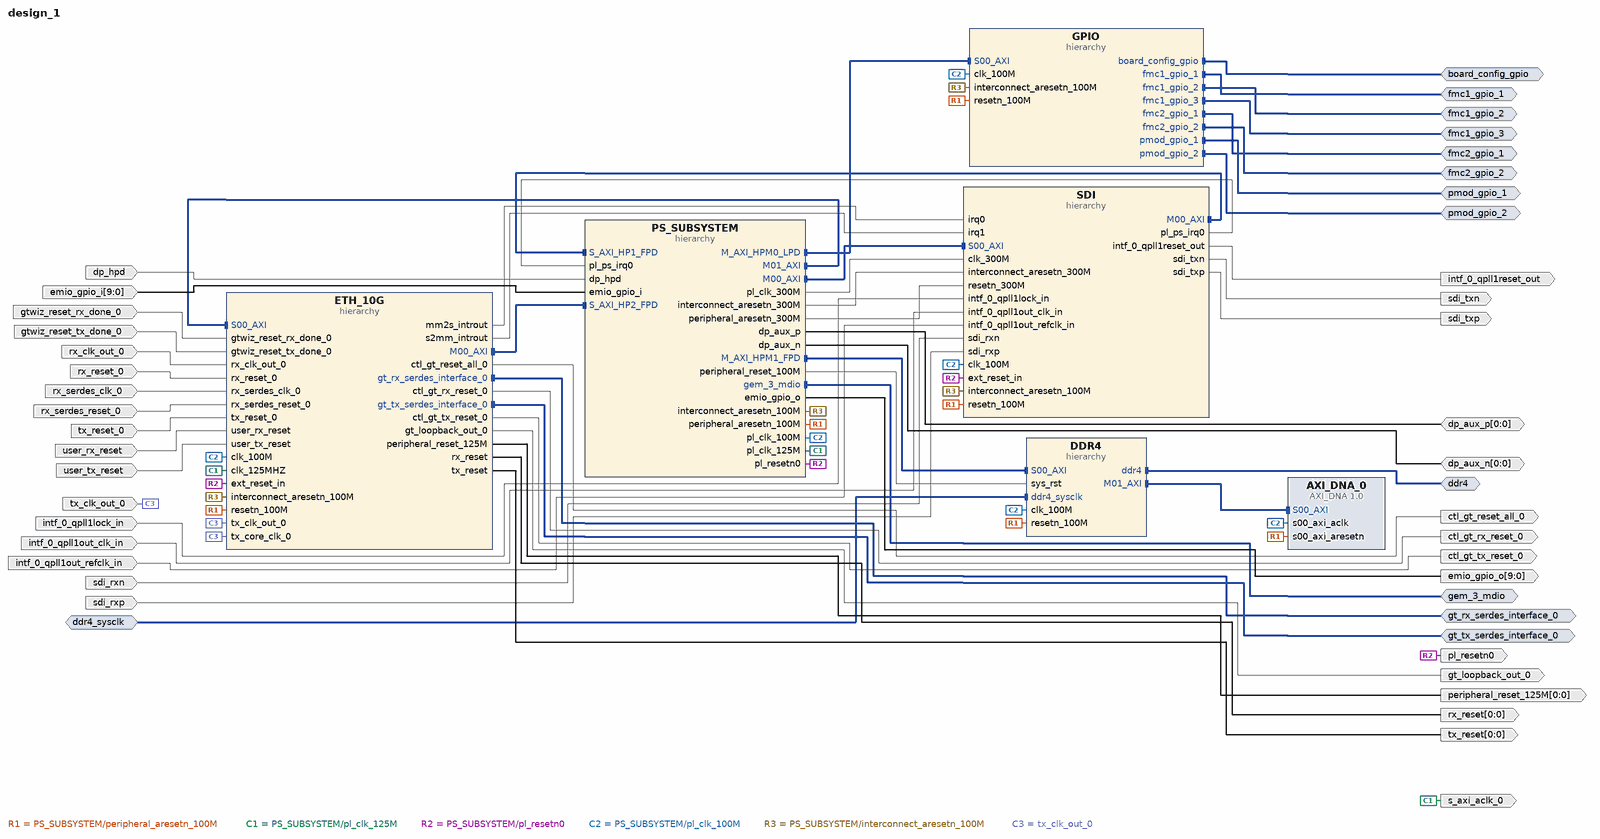
[diagram p0: block diagram of the top level]
# Vivado block design design_1, xczu7cg-fbvb900-1-i, Vivado 2023.2
create_bd_design design_1

create_bd_intf_port -mode Master -vlnv xilinx.com:interface:mdio_rtl:1.0 gem_3_mdio
create_bd_intf_port -mode Master -vlnv xilinx.com:interface:ddr4_rtl:1.0 ddr4
create_bd_intf_port -mode Slave -vlnv xilinx.com:interface:diff_clock_rtl:1.0 ddr4_sysclk
set_property -dict {CONFIG.FREQ_HZ 300000000} [get_bd_intf_ports ddr4_sysclk]
create_bd_intf_port -mode Master -vlnv xilinx.com:interface:gpio_rtl:1.0 board_config_gpio
create_bd_intf_port -mode Master -vlnv xilinx.com:interface:gpio_rtl:1.0 pmod_gpio_1
create_bd_intf_port -mode Master -vlnv xilinx.com:interface:gpio_rtl:1.0 pmod_gpio_2
create_bd_intf_port -mode Master -vlnv xilinx.com:interface:gpio_rtl:1.0 fmc1_gpio_1
create_bd_intf_port -mode Master -vlnv xilinx.com:interface:gpio_rtl:1.0 fmc1_gpio_2
create_bd_intf_port -mode Master -vlnv xilinx.com:interface:gpio_rtl:1.0 fmc1_gpio_3
create_bd_intf_port -mode Master -vlnv xilinx.com:interface:gpio_rtl:1.0 fmc2_gpio_1
create_bd_intf_port -mode Master -vlnv xilinx.com:interface:gpio_rtl:1.0 fmc2_gpio_2
create_bd_intf_port -mode Master -vlnv xilinx.com:interface:gt_tx_interface_rtl:1.0 gt_tx_serdes_interface_0
create_bd_intf_port -mode Master -vlnv xilinx.com:interface:gt_rx_interface_rtl:1.0 gt_rx_serdes_interface_0
create_bd_port -dir IO -from 0 -to 0 dp_aux_p
create_bd_port -dir IO -from 0 -to 0 dp_aux_n
create_bd_port -dir I dp_hpd
create_bd_port -dir I sdi_rxp
create_bd_port -dir I sdi_rxn
create_bd_port -dir O sdi_txp
create_bd_port -dir O sdi_txn
create_bd_port -dir I -from 9 -to 0 emio_gpio_i
create_bd_port -dir I intf_0_qpll1out_clk_in
create_bd_port -dir I intf_0_qpll1out_refclk_in
create_bd_port -dir I intf_0_qpll1lock_in
create_bd_port -dir O intf_0_qpll1reset_out
create_bd_port -dir I rx_serdes_clk_0
create_bd_port -dir I rx_serdes_reset_0
create_bd_port -dir I rx_reset_0
create_bd_port -dir I tx_reset_0
create_bd_port -dir I gtwiz_reset_tx_done_0
create_bd_port -dir I gtwiz_reset_rx_done_0
create_bd_port -dir I user_rx_reset
create_bd_port -dir I user_tx_reset
create_bd_port -dir O -from 0 -to 0 peripheral_reset_125M
create_bd_port -dir O ctl_gt_reset_all_0
create_bd_port -dir O ctl_gt_tx_reset_0
create_bd_port -dir O ctl_gt_rx_reset_0
create_bd_port -dir O gt_loopback_out_0
create_bd_port -dir O -from 0 -to 0 tx_reset
create_bd_port -dir O -from 0 -to 0 rx_reset
create_bd_port -dir O s_axi_aclk_0
create_bd_port -dir O pl_resetn0
create_bd_port -dir I -type clk rx_clk_out_0
set_property -dict {CONFIG.FREQ_HZ 156250000} [get_bd_ports rx_clk_out_0]
create_bd_port -dir I -type clk tx_clk_out_0
set_property -dict {CONFIG.FREQ_HZ 156250000} [get_bd_ports tx_clk_out_0]
create_bd_port -dir O -from 9 -to 0 emio_gpio_o

create_bd_cell -type hier PS_SUBSYSTEM
create_bd_cell -type hier DDR4
create_bd_cell -type hier GPIO
create_bd_cell -type hier SDI
create_bd_cell -type hier ETH_10G
create_bd_cell -type ip -vlnv xilinx.com:user:AXI_DNA:1.0 AXI_DNA_0

# ---- hierarchy /PS_SUBSYSTEM ----
current_bd_instance /PS_SUBSYSTEM
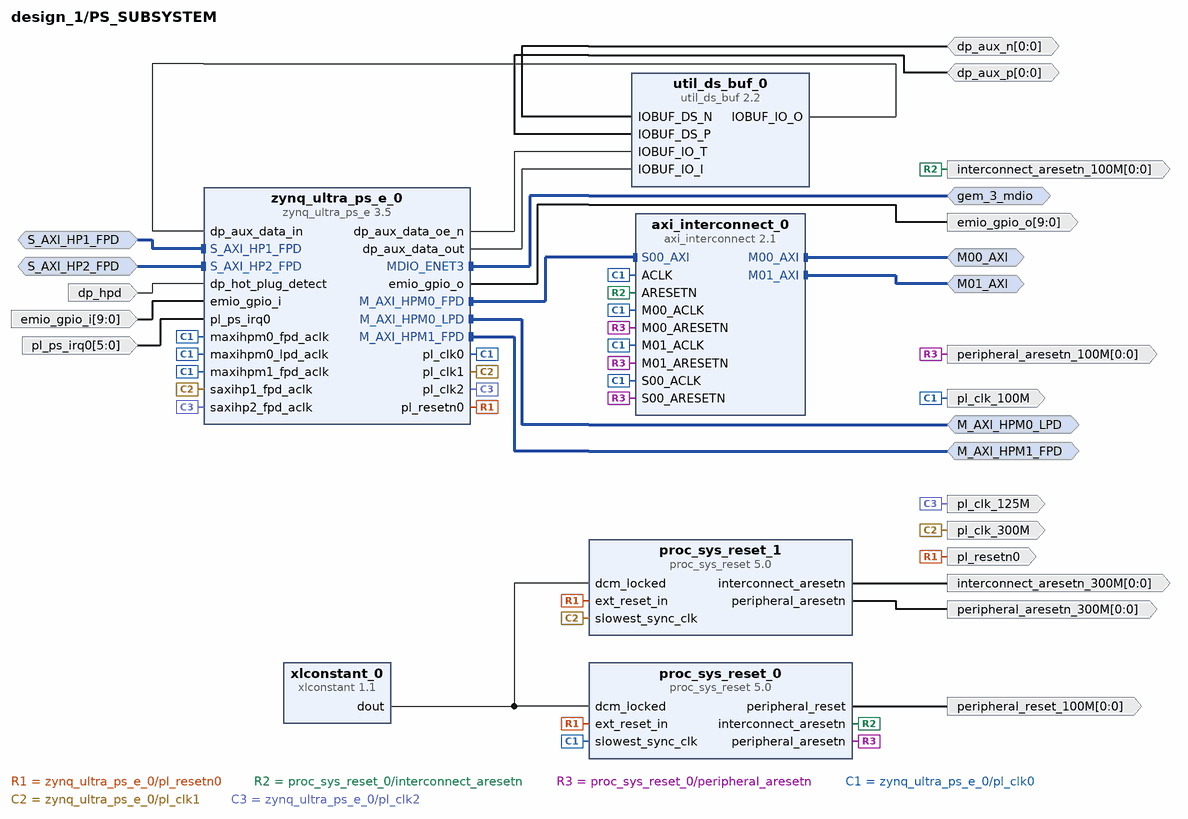
[diagram p1: block diagram inside /PS_SUBSYSTEM]
create_bd_intf_pin -mode Master -vlnv xilinx.com:interface:mdio_rtl:1.0 gem_3_mdio
create_bd_intf_pin -mode Slave -vlnv xilinx.com:interface:aximm_rtl:1.0 S_AXI_HP1_FPD
create_bd_intf_pin -mode Master -vlnv xilinx.com:interface:aximm_rtl:1.0 M00_AXI
create_bd_intf_pin -mode Master -vlnv xilinx.com:interface:aximm_rtl:1.0 M01_AXI
create_bd_intf_pin -mode Master -vlnv xilinx.com:interface:aximm_rtl:1.0 M_AXI_HPM1_FPD
create_bd_intf_pin -mode Master -vlnv xilinx.com:interface:aximm_rtl:1.0 M_AXI_HPM0_LPD
create_bd_intf_pin -mode Slave -vlnv xilinx.com:interface:aximm_rtl:1.0 S_AXI_HP2_FPD
create_bd_pin -dir IO -from 0 -to 0 dp_aux_p
create_bd_pin -dir IO -from 0 -to 0 dp_aux_n
create_bd_pin -dir I dp_hpd
create_bd_pin -dir O pl_clk_100M
create_bd_pin -dir O pl_clk_300M
create_bd_pin -dir O -from 0 -to 0 peripheral_aresetn_100M
create_bd_pin -dir O -from 0 -to 0 peripheral_aresetn_300M
create_bd_pin -dir O -from 0 -to 0 interconnect_aresetn_100M
create_bd_pin -dir O -from 0 -to 0 interconnect_aresetn_300M
create_bd_pin -dir O -from 0 -to 0 peripheral_reset_100M
create_bd_pin -dir O pl_resetn0
create_bd_pin -dir I -from 9 -to 0 emio_gpio_i
create_bd_pin -dir O pl_clk_125M
create_bd_pin -dir I -from 5 -to 0 -type intr pl_ps_irq0
create_bd_pin -dir O -from 9 -to 0 emio_gpio_o

create_bd_cell -type ip -vlnv xilinx.com:ip:axi_interconnect:2.1 axi_interconnect_0
create_bd_cell -type ip -vlnv xilinx.com:ip:proc_sys_reset:5.0 proc_sys_reset_0
create_bd_cell -type ip -vlnv xilinx.com:ip:proc_sys_reset:5.0 proc_sys_reset_1
create_bd_cell -type ip -vlnv xilinx.com:ip:util_ds_buf:2.2 util_ds_buf_0
set_property -dict {CONFIG.C_BUF_TYPE IOBUFDS} [get_bd_cells util_ds_buf_0]
create_bd_cell -type ip -vlnv xilinx.com:ip:xlconstant:1.1 xlconstant_0
create_bd_cell -type ip -vlnv xilinx.com:ip:zynq_ultra_ps_e:3.5 zynq_ultra_ps_e_0
set_property -dict [list \
  CONFIG.CAN0_BOARD_INTERFACE custom \
  CONFIG.CAN1_BOARD_INTERFACE custom \
  CONFIG.CSU_BOARD_INTERFACE custom \
  CONFIG.DP_BOARD_INTERFACE custom \
  CONFIG.GEM0_BOARD_INTERFACE custom \
  CONFIG.GEM1_BOARD_INTERFACE custom \
  CONFIG.GEM2_BOARD_INTERFACE custom \
  CONFIG.GEM3_BOARD_INTERFACE custom \
  CONFIG.GPIO_BOARD_INTERFACE custom \
  CONFIG.IIC0_BOARD_INTERFACE custom \
  CONFIG.IIC1_BOARD_INTERFACE custom \
  CONFIG.NAND_BOARD_INTERFACE custom \
  CONFIG.PCIE_BOARD_INTERFACE custom \
  CONFIG.PJTAG_BOARD_INTERFACE custom \
  CONFIG.PMU_BOARD_INTERFACE custom \
  CONFIG.PSU_BANK_0_IO_STANDARD LVCMOS18 \
  CONFIG.PSU_BANK_1_IO_STANDARD LVCMOS18 \
  CONFIG.PSU_BANK_2_IO_STANDARD LVCMOS18 \
  CONFIG.PSU_BANK_3_IO_STANDARD LVCMOS18 \
  CONFIG.PSU_USB3__DUAL_CLOCK_ENABLE 1 \
  CONFIG.PSU__ACPU2__POWER__ON 0 \
  CONFIG.PSU__ACPU3__POWER__ON 0 \
  CONFIG.PSU__CAN0__PERIPHERAL__ENABLE 1 \
  CONFIG.PSU__CAN0__PERIPHERAL__IO {MIO 38 .. 39} \
  CONFIG.PSU__CAN1__PERIPHERAL__ENABLE 1 \
  CONFIG.PSU__CAN1__PERIPHERAL__IO {MIO 40 .. 41} \
  CONFIG.PSU__CRF_APB__ACPU_CTRL__FREQMHZ 1200 \
  CONFIG.PSU__CRF_APB__ACPU_CTRL__SRCSEL DPLL \
  CONFIG.PSU__CRF_APB__APLL_CTRL__SRCSEL PSS_REF_CLK \
  CONFIG.PSU__CRF_APB__DBG_FPD_CTRL__FREQMHZ 250 \
  CONFIG.PSU__CRF_APB__DBG_FPD_CTRL__SRCSEL IOPLL \
  CONFIG.PSU__CRF_APB__DBG_TRACE_CTRL__FREQMHZ 250 \
  CONFIG.PSU__CRF_APB__DBG_TRACE_CTRL__SRCSEL IOPLL \
  CONFIG.PSU__CRF_APB__DBG_TSTMP_CTRL__FREQMHZ 250 \
  CONFIG.PSU__CRF_APB__DBG_TSTMP_CTRL__SRCSEL IOPLL \
  CONFIG.PSU__CRF_APB__DDR_CTRL__FREQMHZ 1200 \
  CONFIG.PSU__CRF_APB__DDR_CTRL__SRCSEL DPLL \
  CONFIG.PSU__CRF_APB__DPDMA_REF_CTRL__FREQMHZ 600 \
  CONFIG.PSU__CRF_APB__DPDMA_REF_CTRL__SRCSEL DPLL \
  CONFIG.PSU__CRF_APB__DPLL_CTRL__SRCSEL PSS_REF_CLK \
  CONFIG.PSU__CRF_APB__DP_AUDIO_REF_CTRL__SRCSEL RPLL \
  CONFIG.PSU__CRF_APB__DP_STC_REF_CTRL__SRCSEL RPLL \
  CONFIG.PSU__CRF_APB__DP_VIDEO_REF_CTRL__SRCSEL VPLL \
  CONFIG.PSU__CRF_APB__GDMA_REF_CTRL__FREQMHZ 600 \
  CONFIG.PSU__CRF_APB__GDMA_REF_CTRL__SRCSEL DPLL \
  CONFIG.PSU__CRF_APB__GPU_REF_CTRL__FREQMHZ 600 \
  CONFIG.PSU__CRF_APB__GPU_REF_CTRL__SRCSEL DPLL \
  CONFIG.PSU__CRF_APB__TOPSW_LSBUS_CTRL__FREQMHZ 100 \
  CONFIG.PSU__CRF_APB__TOPSW_LSBUS_CTRL__SRCSEL IOPLL \
  CONFIG.PSU__CRF_APB__TOPSW_MAIN_CTRL__FREQMHZ 533.333 \
  CONFIG.PSU__CRF_APB__TOPSW_MAIN_CTRL__SRCSEL APLL \
  CONFIG.PSU__CRF_APB__VPLL_CTRL__SRCSEL PSS_REF_CLK \
  CONFIG.PSU__CRL_APB__ADMA_REF_CTRL__FREQMHZ 500 \
  CONFIG.PSU__CRL_APB__ADMA_REF_CTRL__SRCSEL IOPLL \
  CONFIG.PSU__CRL_APB__CAN1_REF_CTRL__FREQMHZ 100 \
  CONFIG.PSU__CRL_APB__CAN1_REF_CTRL__SRCSEL IOPLL \
  CONFIG.PSU__CRL_APB__CPU_R5_CTRL__FREQMHZ 500 \
  CONFIG.PSU__CRL_APB__CPU_R5_CTRL__SRCSEL IOPLL \
  CONFIG.PSU__CRL_APB__DBG_LPD_CTRL__FREQMHZ 250 \
  CONFIG.PSU__CRL_APB__DBG_LPD_CTRL__SRCSEL IOPLL \
  CONFIG.PSU__CRL_APB__GEM3_REF_CTRL__FREQMHZ 125 \
  CONFIG.PSU__CRL_APB__GEM3_REF_CTRL__SRCSEL IOPLL \
  CONFIG.PSU__CRL_APB__I2C0_REF_CTRL__FREQMHZ 100 \
  CONFIG.PSU__CRL_APB__I2C0_REF_CTRL__SRCSEL IOPLL \
  CONFIG.PSU__CRL_APB__I2C1_REF_CTRL__FREQMHZ 100 \
  CONFIG.PSU__CRL_APB__I2C1_REF_CTRL__SRCSEL IOPLL \
  CONFIG.PSU__CRL_APB__IOPLL_CTRL__SRCSEL PSS_REF_CLK \
  CONFIG.PSU__CRL_APB__IOU_SWITCH_CTRL__FREQMHZ 267 \
  CONFIG.PSU__CRL_APB__IOU_SWITCH_CTRL__SRCSEL IOPLL \
  CONFIG.PSU__CRL_APB__LPD_LSBUS_CTRL__FREQMHZ 100 \
  CONFIG.PSU__CRL_APB__LPD_LSBUS_CTRL__SRCSEL IOPLL \
  CONFIG.PSU__CRL_APB__LPD_SWITCH_CTRL__FREQMHZ 500 \
  CONFIG.PSU__CRL_APB__LPD_SWITCH_CTRL__SRCSEL IOPLL \
  CONFIG.PSU__CRL_APB__PCAP_CTRL__FREQMHZ 200 \
  CONFIG.PSU__CRL_APB__PCAP_CTRL__SRCSEL IOPLL \
  CONFIG.PSU__CRL_APB__PL0_REF_CTRL__FREQMHZ 100 \
  CONFIG.PSU__CRL_APB__PL0_REF_CTRL__SRCSEL IOPLL \
  CONFIG.PSU__CRL_APB__PL1_REF_CTRL__FREQMHZ 300 \
  CONFIG.PSU__CRL_APB__PL1_REF_CTRL__SRCSEL IOPLL \
  CONFIG.PSU__CRL_APB__PL2_REF_CTRL__FREQMHZ 125 \
  CONFIG.PSU__CRL_APB__PL2_REF_CTRL__SRCSEL IOPLL \
  CONFIG.PSU__CRL_APB__QSPI_REF_CTRL__FREQMHZ 300 \
  CONFIG.PSU__CRL_APB__QSPI_REF_CTRL__SRCSEL IOPLL \
  CONFIG.PSU__CRL_APB__RPLL_CTRL__SRCSEL PSS_REF_CLK \
  CONFIG.PSU__CRL_APB__SDIO0_REF_CTRL__SRCSEL IOPLL \
  CONFIG.PSU__CRL_APB__SDIO1_REF_CTRL__FREQMHZ 200 \
  CONFIG.PSU__CRL_APB__SDIO1_REF_CTRL__SRCSEL IOPLL \
  CONFIG.PSU__CRL_APB__SPI0_REF_CTRL__SRCSEL IOPLL \
  CONFIG.PSU__CRL_APB__TIMESTAMP_REF_CTRL__FREQMHZ 100 \
  CONFIG.PSU__CRL_APB__TIMESTAMP_REF_CTRL__SRCSEL IOPLL \
  CONFIG.PSU__CRL_APB__UART0_REF_CTRL__FREQMHZ 100 \
  CONFIG.PSU__CRL_APB__UART0_REF_CTRL__SRCSEL IOPLL \
  CONFIG.PSU__CRL_APB__UART1_REF_CTRL__FREQMHZ 100 \
  CONFIG.PSU__CRL_APB__UART1_REF_CTRL__SRCSEL IOPLL \
  CONFIG.PSU__CRL_APB__USB0_BUS_REF_CTRL__FREQMHZ 250 \
  CONFIG.PSU__CRL_APB__USB0_BUS_REF_CTRL__SRCSEL IOPLL \
  CONFIG.PSU__CRL_APB__USB3_DUAL_REF_CTRL__FREQMHZ 20 \
  CONFIG.PSU__CRL_APB__USB3_DUAL_REF_CTRL__SRCSEL IOPLL \
  CONFIG.PSU__CRL_APB__USB3__ENABLE 1 \
  CONFIG.PSU__CSUPMU__PERIPHERAL__VALID 0 \
  CONFIG.PSU__DDRC__BUS_WIDTH {64 Bit} \
  CONFIG.PSU__DDRC__COMPONENTS Components \
  CONFIG.PSU__DDRC__DEVICE_CAPACITY {8192 MBits} \
  CONFIG.PSU__DDRC__DRAM_WIDTH {16 Bits} \
  CONFIG.PSU__DDRC__ECC Enabled \
  CONFIG.PSU__DDRC__MEMORY_TYPE {DDR 4} \
  CONFIG.PSU__DDRC__SPEED_BIN DDR4_2400R \
  CONFIG.PSU__DDR_HIGH_ADDRESS_GUI_ENABLE 1 \
  CONFIG.PSU__DDR__INTERFACE__FREQMHZ 600.000 \
  CONFIG.PSU__DEVICE_TYPE CG \
  CONFIG.PSU__DISPLAYPORT__LANE0__ENABLE 1 \
  CONFIG.PSU__DISPLAYPORT__LANE0__IO {GT Lane1} \
  CONFIG.PSU__DISPLAYPORT__LANE1__ENABLE 0 \
  CONFIG.PSU__DISPLAYPORT__PERIPHERAL__ENABLE 1 \
  CONFIG.PSU__DLL__ISUSED 1 \
  CONFIG.PSU__DPAUX__PERIPHERAL__ENABLE 1 \
  CONFIG.PSU__DPAUX__PERIPHERAL__IO EMIO \
  CONFIG.PSU__DP__LANE_SEL {Single Lower} \
  CONFIG.PSU__DP__REF_CLK_FREQ 27 \
  CONFIG.PSU__DP__REF_CLK_SEL {Ref Clk1} \
  CONFIG.PSU__ENET0__GRP_MDIO__ENABLE 1 \
  CONFIG.PSU__ENET0__GRP_MDIO__IO {MIO 76 .. 77} \
  CONFIG.PSU__ENET0__PERIPHERAL__ENABLE 1 \
  CONFIG.PSU__ENET0__PERIPHERAL__IO {MIO 26 .. 37} \
  CONFIG.PSU__ENET3__FIFO__ENABLE 0 \
  CONFIG.PSU__ENET3__GRP_MDIO__ENABLE 1 \
  CONFIG.PSU__ENET3__GRP_MDIO__IO EMIO \
  CONFIG.PSU__ENET3__PERIPHERAL__ENABLE 1 \
  CONFIG.PSU__ENET3__PERIPHERAL__IO {MIO 64 .. 75} \
  CONFIG.PSU__ENET3__PTP__ENABLE 0 \
  CONFIG.PSU__ENET3__TSU__ENABLE 0 \
  CONFIG.PSU__FPGA_PL0_ENABLE 1 \
  CONFIG.PSU__FPGA_PL1_ENABLE 1 \
  CONFIG.PSU__FPGA_PL2_ENABLE 1 \
  CONFIG.PSU__GEM3_COHERENCY 0 \
  CONFIG.PSU__GEM3_ROUTE_THROUGH_FPD 0 \
  CONFIG.PSU__GEM__TSU__ENABLE 0 \
  CONFIG.PSU__GPIO0_MIO__IO {MIO 0 .. 25} \
  CONFIG.PSU__GPIO0_MIO__PERIPHERAL__ENABLE 1 \
  CONFIG.PSU__GPIO1_MIO__IO {MIO 26 .. 51} \
  CONFIG.PSU__GPIO1_MIO__PERIPHERAL__ENABLE 1 \
  CONFIG.PSU__GPIO_EMIO_WIDTH 95 \
  CONFIG.PSU__GPIO_EMIO__PERIPHERAL__ENABLE 1 \
  CONFIG.PSU__GPIO_EMIO__PERIPHERAL__IO 95 \
  CONFIG.PSU__GPU_PP0__POWER__ON 0 \
  CONFIG.PSU__GPU_PP1__POWER__ON 0 \
  CONFIG.PSU__GT__LINK_SPEED HBR \
  CONFIG.PSU__GT__PRE_EMPH_LVL_4 0 \
  CONFIG.PSU__GT__VLT_SWNG_LVL_4 0 \
  CONFIG.PSU__I2C0__PERIPHERAL__ENABLE 1 \
  CONFIG.PSU__I2C0__PERIPHERAL__IO {MIO 10 .. 11} \
  CONFIG.PSU__I2C1__PERIPHERAL__ENABLE 0 \
  CONFIG.PSU__IOU_SLCR__IOU_TTC_APB_CLK__TTC0_SEL APB \
  CONFIG.PSU__IOU_SLCR__IOU_TTC_APB_CLK__TTC1_SEL APB \
  CONFIG.PSU__IOU_SLCR__IOU_TTC_APB_CLK__TTC2_SEL APB \
  CONFIG.PSU__IOU_SLCR__IOU_TTC_APB_CLK__TTC3_SEL APB \
  CONFIG.PSU__LPD_SLCR__CSUPMU__FREQMHZ 100 \
  CONFIG.PSU__MAXIGP0__DATA_WIDTH 128 \
  CONFIG.PSU__OVERRIDE_HPX_QOS 0 \
  CONFIG.PSU__OVERRIDE__BASIC_CLOCK 0 \
  CONFIG.PSU__PCIE__BAR0_VAL 0x0 \
  CONFIG.PSU__PCIE__BAR1_VAL 0x0 \
  CONFIG.PSU__PCIE__BAR2_VAL 0x0 \
  CONFIG.PSU__PCIE__BAR3_VAL 0x0 \
  CONFIG.PSU__PCIE__BAR4_VAL 0x0 \
  CONFIG.PSU__PCIE__BAR5_VAL 0x0 \
  CONFIG.PSU__PCIE__CLASS_CODE_BASE 0x06 \
  CONFIG.PSU__PCIE__CLASS_CODE_INTERFACE 0x0 \
  CONFIG.PSU__PCIE__CLASS_CODE_SUB 0x04 \
  CONFIG.PSU__PCIE__CLASS_CODE_VALUE 0x60400 \
  CONFIG.PSU__PCIE__CRS_SW_VISIBILITY 1 \
  CONFIG.PSU__PCIE__DEVICE_ID 0xD021 \
  CONFIG.PSU__PCIE__DEVICE_PORT_TYPE {Root Port} \
  CONFIG.PSU__PCIE__EROM_VAL 0x0 \
  CONFIG.PSU__PCIE__LANE0__ENABLE 1 \
  CONFIG.PSU__PCIE__LANE0__IO {GT Lane0} \
  CONFIG.PSU__PCIE__LINK_SPEED {5.0 Gb/s} \
  CONFIG.PSU__PCIE__MAXIMUM_LINK_WIDTH x1 \
  CONFIG.PSU__PCIE__MAX_PAYLOAD_SIZE {256 bytes} \
  CONFIG.PSU__PCIE__PERIPHERAL__ENABLE 1 \
  CONFIG.PSU__PCIE__PERIPHERAL__ENDPOINT_ENABLE 0 \
  CONFIG.PSU__PCIE__PERIPHERAL__ROOTPORT_ENABLE 1 \
  CONFIG.PSU__PCIE__PERIPHERAL__ROOTPORT_IO {MIO 1} \
  CONFIG.PSU__PCIE__REF_CLK_FREQ 100 \
  CONFIG.PSU__PCIE__REF_CLK_SEL {Ref Clk0} \
  CONFIG.PSU__PCIE__REVISION_ID 0x0 \
  CONFIG.PSU__PCIE__SUBSYSTEM_ID 0x7 \
  CONFIG.PSU__PCIE__SUBSYSTEM_VENDOR_ID 0x10EE \
  CONFIG.PSU__PCIE__VENDOR_ID 0x10EE \
  CONFIG.PSU__PMU__PERIPHERAL__ENABLE 0 \
  CONFIG.PSU__PRESET_APPLIED 0 \
  CONFIG.PSU__PSS_REF_CLK__FREQMHZ 33.333333 \
  CONFIG.PSU__QSPI__PERIPHERAL__ENABLE 0 \
  CONFIG.PSU__SATA__LANE1__IO {GT Lane3} \
  CONFIG.PSU__SATA__PERIPHERAL__ENABLE 1 \
  CONFIG.PSU__SATA__REF_CLK_FREQ 125 \
  CONFIG.PSU__SATA__REF_CLK_SEL {Ref Clk3} \
  CONFIG.PSU__SD0__CLK_200_SDR_OTAP_DLY 0x3 \
  CONFIG.PSU__SD0__CLK_50_DDR_ITAP_DLY 0x12 \
  CONFIG.PSU__SD0__CLK_50_DDR_OTAP_DLY 0x6 \
  CONFIG.PSU__SD0__CLK_50_SDR_ITAP_DLY 0x15 \
  CONFIG.PSU__SD0__CLK_50_SDR_OTAP_DLY 0x6 \
  CONFIG.PSU__SD0__DATA_TRANSFER_MODE 8Bit \
  CONFIG.PSU__SD0__GRP_POW__ENABLE 1 \
  CONFIG.PSU__SD0__GRP_POW__IO {MIO 23} \
  CONFIG.PSU__SD0__PERIPHERAL__ENABLE 1 \
  CONFIG.PSU__SD0__PERIPHERAL__IO {MIO 13 .. 22} \
  CONFIG.PSU__SD0__RESET__ENABLE 1 \
  CONFIG.PSU__SD0__SLOT_TYPE eMMC \
  CONFIG.PSU__SD1_COHERENCY 0 \
  CONFIG.PSU__SD1_ROUTE_THROUGH_FPD 0 \
  CONFIG.PSU__SD1__CLK_50_SDR_ITAP_DLY 0x15 \
  CONFIG.PSU__SD1__CLK_50_SDR_OTAP_DLY 0x5 \
  CONFIG.PSU__SD1__DATA_TRANSFER_MODE 4Bit \
  CONFIG.PSU__SD1__GRP_CD__ENABLE 1 \
  CONFIG.PSU__SD1__GRP_CD__IO {MIO 45} \
  CONFIG.PSU__SD1__GRP_POW__ENABLE 0 \
  CONFIG.PSU__SD1__GRP_WP__ENABLE 1 \
  CONFIG.PSU__SD1__GRP_WP__IO {MIO 44} \
  CONFIG.PSU__SD1__PERIPHERAL__ENABLE 1 \
  CONFIG.PSU__SD1__PERIPHERAL__IO {MIO 46 .. 51} \
  CONFIG.PSU__SD1__SLOT_TYPE {SD 2.0} \
  CONFIG.PSU__SPI0__GRP_SS0__IO {MIO 3} \
  CONFIG.PSU__SPI0__PERIPHERAL__ENABLE 1 \
  CONFIG.PSU__SPI0__PERIPHERAL__IO {MIO 0 .. 5} \
  CONFIG.PSU__SWDT0__CLOCK__ENABLE 0 \
  CONFIG.PSU__SWDT0__PERIPHERAL__ENABLE 1 \
  CONFIG.PSU__SWDT0__RESET__ENABLE 0 \
  CONFIG.PSU__SWDT1__CLOCK__ENABLE 0 \
  CONFIG.PSU__SWDT1__PERIPHERAL__ENABLE 1 \
  CONFIG.PSU__SWDT1__RESET__ENABLE 0 \
  CONFIG.PSU__TSU__BUFG_PORT_PAIR 0 \
  CONFIG.PSU__TTC0__CLOCK__ENABLE 0 \
  CONFIG.PSU__TTC0__PERIPHERAL__ENABLE 1 \
  CONFIG.PSU__TTC0__WAVEOUT__ENABLE 0 \
  CONFIG.PSU__TTC1__CLOCK__ENABLE 0 \
  CONFIG.PSU__TTC1__PERIPHERAL__ENABLE 1 \
  CONFIG.PSU__TTC1__WAVEOUT__ENABLE 0 \
  CONFIG.PSU__TTC2__CLOCK__ENABLE 0 \
  CONFIG.PSU__TTC2__PERIPHERAL__ENABLE 1 \
  CONFIG.PSU__TTC2__WAVEOUT__ENABLE 0 \
  CONFIG.PSU__TTC3__CLOCK__ENABLE 0 \
  CONFIG.PSU__TTC3__PERIPHERAL__ENABLE 1 \
  CONFIG.PSU__TTC3__WAVEOUT__ENABLE 0 \
  CONFIG.PSU__UART0__BAUD_RATE 115200 \
  CONFIG.PSU__UART0__MODEM__ENABLE 0 \
  CONFIG.PSU__UART0__PERIPHERAL__ENABLE 1 \
  CONFIG.PSU__UART0__PERIPHERAL__IO {MIO 6 .. 7} \
  CONFIG.PSU__UART1__BAUD_RATE 115200 \
  CONFIG.PSU__UART1__MODEM__ENABLE 0 \
  CONFIG.PSU__UART1__PERIPHERAL__ENABLE 1 \
  CONFIG.PSU__UART1__PERIPHERAL__IO {MIO 8 .. 9} \
  CONFIG.PSU__USB0_COHERENCY 0 \
  CONFIG.PSU__USB0__PERIPHERAL__ENABLE 1 \
  CONFIG.PSU__USB0__PERIPHERAL__IO {MIO 52 .. 63} \
  CONFIG.PSU__USB0__REF_CLK_FREQ 52 \
  CONFIG.PSU__USB0__REF_CLK_SEL {Ref Clk2} \
  CONFIG.PSU__USB0__RESET__ENABLE 1 \
  CONFIG.PSU__USB0__RESET__IO {MIO 42} \
  CONFIG.PSU__USB2_0__EMIO__ENABLE 0 \
  CONFIG.PSU__USB3_0__EMIO__ENABLE 0 \
  CONFIG.PSU__USB3_0__PERIPHERAL__ENABLE 1 \
  CONFIG.PSU__USB3_0__PERIPHERAL__IO {GT Lane2} \
  CONFIG.PSU__USB__RESET__MODE {Shared MIO Pin} \
  CONFIG.PSU__USB__RESET__POLARITY {Active Low} \
  CONFIG.PSU__USE__IRQ0 1 \
  CONFIG.PSU__USE__M_AXI_GP0 1 \
  CONFIG.PSU__USE__M_AXI_GP1 1 \
  CONFIG.PSU__USE__M_AXI_GP2 1 \
  CONFIG.PSU__USE__S_AXI_GP3 1 \
  CONFIG.PSU__USE__S_AXI_GP4 1 \
  CONFIG.QSPI_BOARD_INTERFACE custom \
  CONFIG.SATA_BOARD_INTERFACE custom \
  CONFIG.SD0_BOARD_INTERFACE custom \
  CONFIG.SD1_BOARD_INTERFACE custom \
  CONFIG.SPI0_BOARD_INTERFACE custom \
  CONFIG.SPI1_BOARD_INTERFACE custom \
  CONFIG.SUBPRESET1 Custom \
  CONFIG.SUBPRESET2 Custom \
  CONFIG.SWDT0_BOARD_INTERFACE custom \
  CONFIG.SWDT1_BOARD_INTERFACE custom \
  CONFIG.TRACE_BOARD_INTERFACE custom \
  CONFIG.TTC0_BOARD_INTERFACE custom \
  CONFIG.TTC1_BOARD_INTERFACE custom \
  CONFIG.TTC2_BOARD_INTERFACE custom \
  CONFIG.TTC3_BOARD_INTERFACE custom \
  CONFIG.UART0_BOARD_INTERFACE custom \
  CONFIG.UART1_BOARD_INTERFACE custom \
  CONFIG.USB0_BOARD_INTERFACE custom \
  CONFIG.USB1_BOARD_INTERFACE custom \
] [get_bd_cells zynq_ultra_ps_e_0]
# 722 more settings of zynq_ultra_ps_e_0 are not shown: defaults, MIO pin electricals, DDR timing, and values the tool derives

# ---- hierarchy /DDR4 ----
current_bd_instance /DDR4
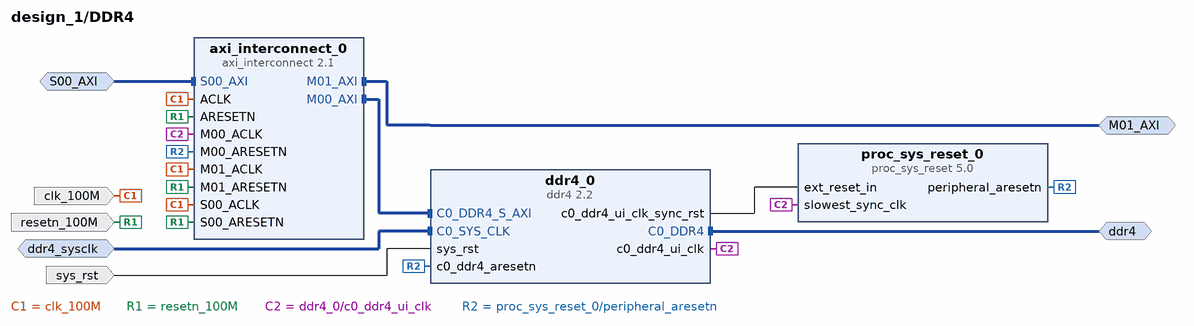
[diagram p2: block diagram inside /DDR4]
create_bd_intf_pin -mode Slave -vlnv xilinx.com:interface:aximm_rtl:1.0 S00_AXI
create_bd_intf_pin -mode Slave -vlnv xilinx.com:interface:diff_clock_rtl:1.0 ddr4_sysclk
create_bd_intf_pin -mode Master -vlnv xilinx.com:interface:ddr4_rtl:1.0 ddr4
create_bd_intf_pin -mode Master -vlnv xilinx.com:interface:aximm_rtl:1.0 M01_AXI
create_bd_pin -dir I clk_100M
create_bd_pin -dir I resetn_100M
create_bd_pin -dir I sys_rst

create_bd_cell -type ip -vlnv xilinx.com:ip:axi_interconnect:2.1 axi_interconnect_0
set_property -dict {CONFIG.NUM_MI 2} [get_bd_cells axi_interconnect_0]
create_bd_cell -type ip -vlnv xilinx.com:ip:ddr4:2.2 ddr4_0
set_property -dict [list \
  CONFIG.C0.BANK_GROUP_WIDTH 1 \
  CONFIG.C0.DDR4_AxiAddressWidth 30 \
  CONFIG.C0.DDR4_AxiDataWidth 128 \
  CONFIG.C0.DDR4_CasLatency 16 \
  CONFIG.C0.DDR4_DataWidth 16 \
  CONFIG.C0.DDR4_InputClockPeriod 3332 \
  CONFIG.C0.DDR4_Mem_Add_Map ROW_COLUMN_BANK \
  CONFIG.C0.DDR4_MemoryPart MT40A512M16HA-083E \
] [get_bd_cells ddr4_0]
create_bd_cell -type ip -vlnv xilinx.com:ip:proc_sys_reset:5.0 proc_sys_reset_0

# ---- hierarchy /GPIO ----
current_bd_instance /GPIO
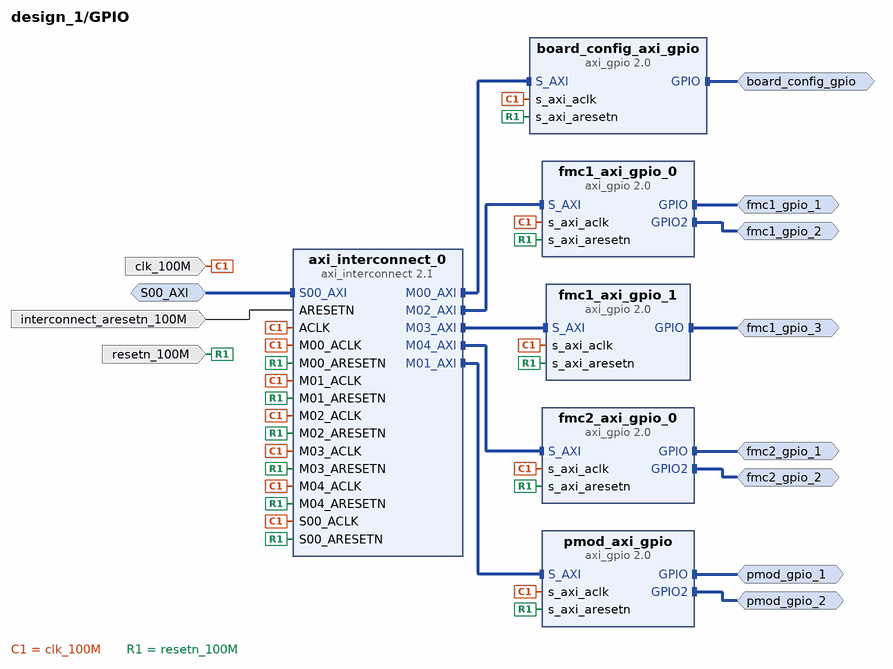
[diagram p3: block diagram inside /GPIO]
create_bd_intf_pin -mode Master -vlnv xilinx.com:interface:gpio_rtl:1.0 board_config_gpio
create_bd_intf_pin -mode Master -vlnv xilinx.com:interface:gpio_rtl:1.0 pmod_gpio_1
create_bd_intf_pin -mode Master -vlnv xilinx.com:interface:gpio_rtl:1.0 pmod_gpio_2
create_bd_intf_pin -mode Master -vlnv xilinx.com:interface:gpio_rtl:1.0 fmc1_gpio_1
create_bd_intf_pin -mode Master -vlnv xilinx.com:interface:gpio_rtl:1.0 fmc1_gpio_2
create_bd_intf_pin -mode Master -vlnv xilinx.com:interface:gpio_rtl:1.0 fmc1_gpio_3
create_bd_intf_pin -mode Master -vlnv xilinx.com:interface:gpio_rtl:1.0 fmc2_gpio_1
create_bd_intf_pin -mode Master -vlnv xilinx.com:interface:gpio_rtl:1.0 fmc2_gpio_2
create_bd_intf_pin -mode Slave -vlnv xilinx.com:interface:aximm_rtl:1.0 S00_AXI
create_bd_pin -dir I clk_100M
create_bd_pin -dir I resetn_100M
create_bd_pin -dir I interconnect_aresetn_100M

create_bd_cell -type ip -vlnv xilinx.com:ip:axi_gpio:2.0 board_config_axi_gpio
set_property -dict {CONFIG.C_ALL_INPUTS 1 CONFIG.C_GPIO_WIDTH 2} [get_bd_cells board_config_axi_gpio]
create_bd_cell -type ip -vlnv xilinx.com:ip:axi_gpio:2.0 pmod_axi_gpio
set_property -dict {CONFIG.C_GPIO2_WIDTH 8 CONFIG.C_GPIO_WIDTH 8 CONFIG.C_IS_DUAL 1} [get_bd_cells pmod_axi_gpio]
create_bd_cell -type ip -vlnv xilinx.com:ip:axi_gpio:2.0 fmc1_axi_gpio_0
set_property -dict {CONFIG.C_IS_DUAL 1} [get_bd_cells fmc1_axi_gpio_0]
create_bd_cell -type ip -vlnv xilinx.com:ip:axi_gpio:2.0 fmc1_axi_gpio_1
set_property -dict {CONFIG.C_GPIO_WIDTH 8} [get_bd_cells fmc1_axi_gpio_1]
create_bd_cell -type ip -vlnv xilinx.com:ip:axi_gpio:2.0 fmc2_axi_gpio_0
set_property -dict {CONFIG.C_GPIO2_WIDTH 20 CONFIG.C_GPIO_WIDTH 20 CONFIG.C_IS_DUAL 1} [get_bd_cells fmc2_axi_gpio_0]
create_bd_cell -type ip -vlnv xilinx.com:ip:axi_interconnect:2.1 axi_interconnect_0
set_property -dict {CONFIG.NUM_MI 5} [get_bd_cells axi_interconnect_0]

# ---- hierarchy /SDI ----
current_bd_instance /SDI
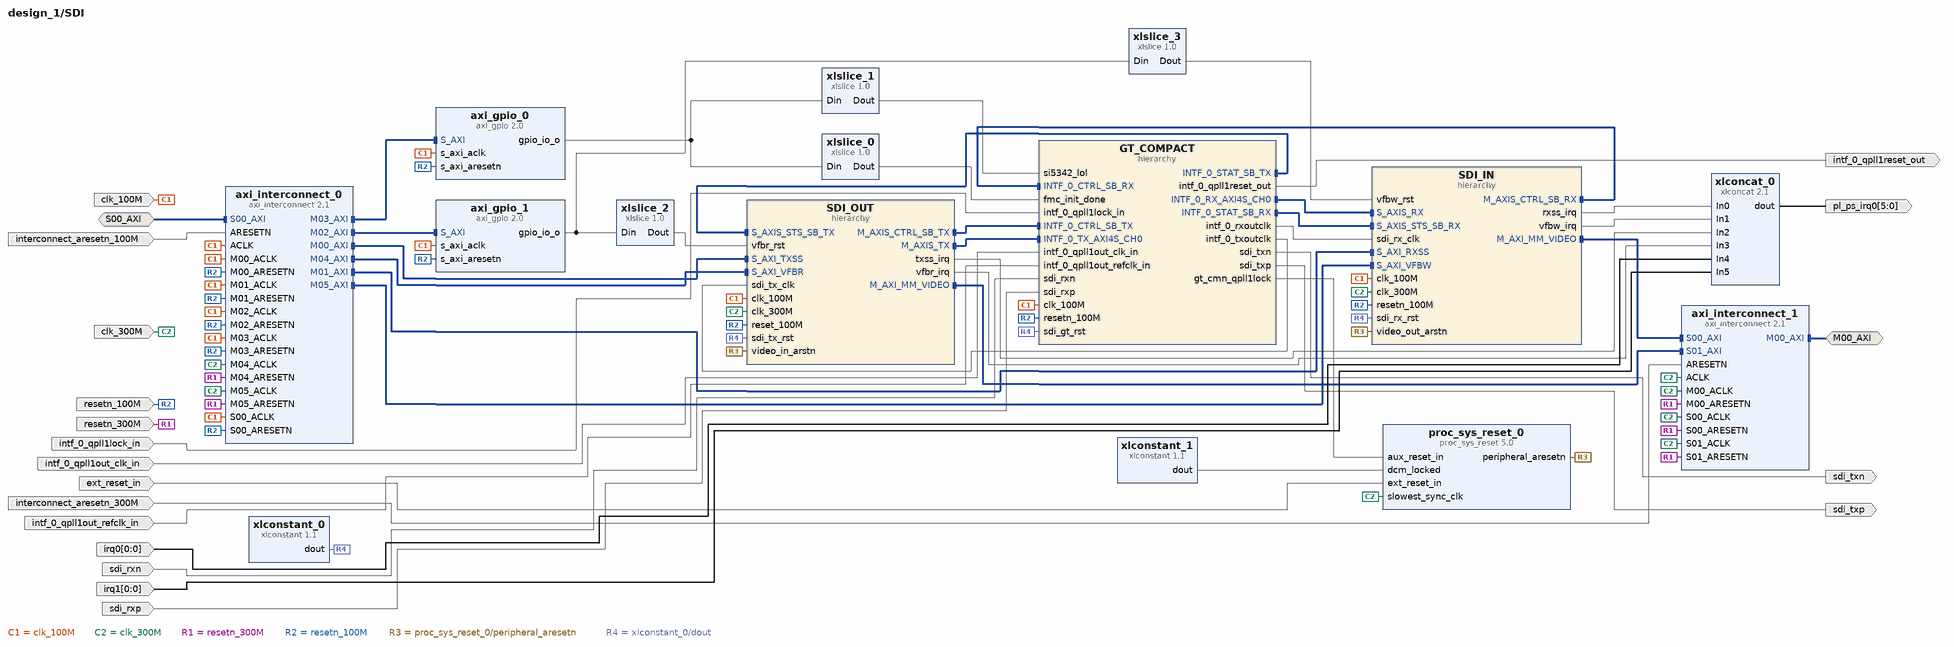
[diagram p4: block diagram inside /SDI]
create_bd_intf_pin -mode Slave -vlnv xilinx.com:interface:aximm_rtl:1.0 S00_AXI
create_bd_intf_pin -mode Master -vlnv xilinx.com:interface:aximm_rtl:1.0 M00_AXI
create_bd_pin -dir I clk_100M
create_bd_pin -dir I resetn_100M
create_bd_pin -dir I clk_300M
create_bd_pin -dir I resetn_300M
create_bd_pin -dir I interconnect_aresetn_100M
create_bd_pin -dir I interconnect_aresetn_300M
create_bd_pin -dir I ext_reset_in
create_bd_pin -dir I sdi_rxp
create_bd_pin -dir I sdi_rxn
create_bd_pin -dir O sdi_txp
create_bd_pin -dir O sdi_txn
create_bd_pin -dir I intf_0_qpll1out_clk_in
create_bd_pin -dir I intf_0_qpll1out_refclk_in
create_bd_pin -dir I intf_0_qpll1lock_in
create_bd_pin -dir O intf_0_qpll1reset_out
create_bd_pin -dir I -from 0 -to 0 irq0
create_bd_pin -dir I -from 0 -to 0 irq1
create_bd_pin -dir O -from 5 -to 0 -type intr pl_ps_irq0

create_bd_cell -type hier SDI_OUT
create_bd_cell -type hier SDI_IN
create_bd_cell -type hier GT_COMPACT
create_bd_cell -type ip -vlnv xilinx.com:ip:axi_gpio:2.0 axi_gpio_0
set_property -dict {CONFIG.C_ALL_OUTPUTS 1 CONFIG.C_DOUT_DEFAULT 0x00000001 CONFIG.C_GPIO_WIDTH 2} [get_bd_cells axi_gpio_0]
create_bd_cell -type ip -vlnv xilinx.com:ip:axi_gpio:2.0 axi_gpio_1
set_property -dict {CONFIG.C_ALL_OUTPUTS 1 CONFIG.C_DOUT_DEFAULT 0x00000001 CONFIG.C_GPIO_WIDTH 2} [get_bd_cells axi_gpio_1]
create_bd_cell -type ip -vlnv xilinx.com:ip:axi_interconnect:2.1 axi_interconnect_0
set_property -dict {CONFIG.NUM_MI 6} [get_bd_cells axi_interconnect_0]
create_bd_cell -type ip -vlnv xilinx.com:ip:axi_interconnect:2.1 axi_interconnect_1
set_property -dict {CONFIG.NUM_MI 1 CONFIG.NUM_SI 2} [get_bd_cells axi_interconnect_1]
create_bd_cell -type ip -vlnv xilinx.com:ip:proc_sys_reset:5.0 proc_sys_reset_0
create_bd_cell -type ip -vlnv xilinx.com:ip:xlconcat:2.1 xlconcat_0
set_property -dict {CONFIG.NUM_PORTS 6 CONFIG.dout_width 6} [get_bd_cells xlconcat_0]
create_bd_cell -type ip -vlnv xilinx.com:ip:xlconstant:1.1 xlconstant_0
set_property -dict {CONFIG.CONST_VAL 0} [get_bd_cells xlconstant_0]
create_bd_cell -type ip -vlnv xilinx.com:ip:xlconstant:1.1 xlconstant_1
create_bd_cell -type ip -vlnv xilinx.com:ip:xlslice:1.0 xlslice_0
set_property -dict {CONFIG.DIN_WIDTH 2} [get_bd_cells xlslice_0]
create_bd_cell -type ip -vlnv xilinx.com:ip:xlslice:1.0 xlslice_2
set_property -dict {CONFIG.DIN_WIDTH 2} [get_bd_cells xlslice_2]
create_bd_cell -type ip -vlnv xilinx.com:ip:xlslice:1.0 xlslice_1
set_property -dict {CONFIG.DIN_FROM 1 CONFIG.DIN_TO 1 CONFIG.DIN_WIDTH 2 CONFIG.DOUT_WIDTH 1} [get_bd_cells xlslice_1]
create_bd_cell -type ip -vlnv xilinx.com:ip:xlslice:1.0 xlslice_3
set_property -dict {CONFIG.DIN_FROM 1 CONFIG.DIN_TO 1 CONFIG.DIN_WIDTH 2 CONFIG.DOUT_WIDTH 1} [get_bd_cells xlslice_3]

# ---- hierarchy /SDI/SDI_OUT ----
current_bd_instance /SDI/SDI_OUT
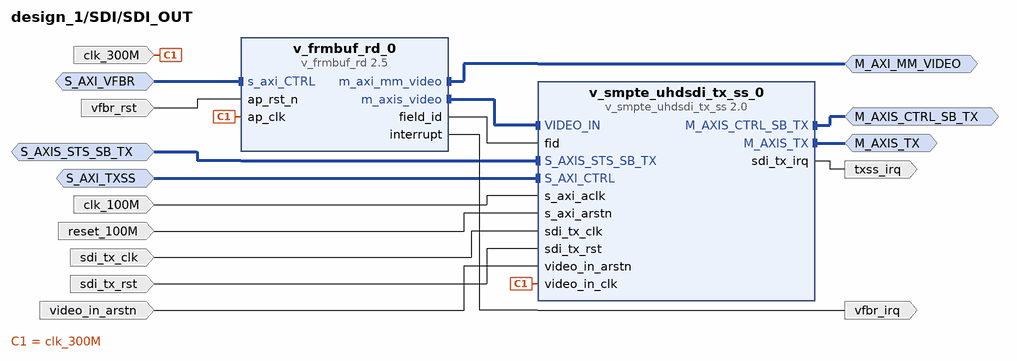
[diagram p5: block diagram inside /SDI/SDI_OUT]
create_bd_intf_pin -mode Master -vlnv xilinx.com:interface:aximm_rtl:1.0 M_AXI_MM_VIDEO
create_bd_intf_pin -mode Master -vlnv xilinx.com:interface:axis_rtl:1.0 M_AXIS_CTRL_SB_TX
create_bd_intf_pin -mode Master -vlnv xilinx.com:interface:axis_rtl:1.0 M_AXIS_TX
create_bd_intf_pin -mode Slave -vlnv xilinx.com:interface:axis_rtl:1.0 S_AXIS_STS_SB_TX
create_bd_intf_pin -mode Slave -vlnv xilinx.com:interface:aximm_rtl:1.0 S_AXI_TXSS
create_bd_intf_pin -mode Slave -vlnv xilinx.com:interface:aximm_rtl:1.0 S_AXI_VFBR
create_bd_pin -dir O txss_irq
create_bd_pin -dir O vfbr_irq
create_bd_pin -dir I sdi_tx_clk
create_bd_pin -dir I sdi_tx_rst
create_bd_pin -dir I clk_300M
create_bd_pin -dir I vfbr_rst
create_bd_pin -dir I video_in_arstn
create_bd_pin -dir I clk_100M
create_bd_pin -dir I reset_100M

create_bd_cell -type ip -vlnv xilinx.com:ip:v_frmbuf_rd:2.5 v_frmbuf_rd_0
set_property -dict [list \
  CONFIG.HAS_BGR8 1 \
  CONFIG.HAS_BGRX8 1 \
  CONFIG.HAS_INTERLACED 1 \
  CONFIG.HAS_RGBX8 1 \
  CONFIG.HAS_RGBX10 1 \
  CONFIG.HAS_UYVY8 1 \
  CONFIG.HAS_Y8 1 \
  CONFIG.HAS_Y10 1 \
  CONFIG.HAS_YUV8 1 \
  CONFIG.HAS_YUVX8 1 \
  CONFIG.HAS_YUVX10 1 \
  CONFIG.HAS_YUYV8 1 \
  CONFIG.HAS_Y_UV10 1 \
  CONFIG.HAS_Y_UV10_420 1 \
  CONFIG.HAS_Y_UV8 1 \
  CONFIG.HAS_Y_UV8_420 1 \
  CONFIG.MAX_DATA_WIDTH 10 \
  CONFIG.MAX_NR_PLANES 2 \
] [get_bd_cells v_frmbuf_rd_0]
create_bd_cell -type ip -vlnv xilinx.com:ip:v_smpte_uhdsdi_tx_ss:2.0 v_smpte_uhdsdi_tx_ss_0

# ---- hierarchy /SDI/SDI_IN ----
current_bd_instance /SDI/SDI_IN
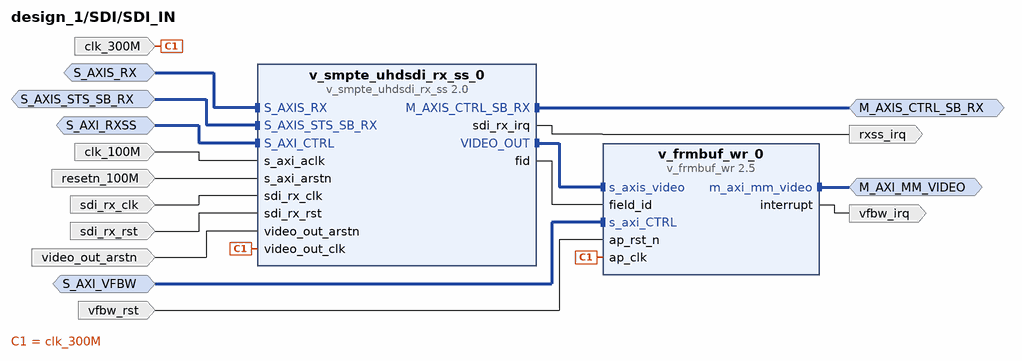
[diagram p6: block diagram inside /SDI/SDI_IN]
create_bd_intf_pin -mode Slave -vlnv xilinx.com:interface:axis_rtl:1.0 S_AXIS_RX
create_bd_intf_pin -mode Slave -vlnv xilinx.com:interface:axis_rtl:1.0 S_AXIS_STS_SB_RX
create_bd_intf_pin -mode Slave -vlnv xilinx.com:interface:aximm_rtl:1.0 S_AXI_RXSS
create_bd_intf_pin -mode Slave -vlnv xilinx.com:interface:aximm_rtl:1.0 S_AXI_VFBW
create_bd_intf_pin -mode Master -vlnv xilinx.com:interface:aximm_rtl:1.0 M_AXI_MM_VIDEO
create_bd_intf_pin -mode Master -vlnv xilinx.com:interface:axis_rtl:1.0 M_AXIS_CTRL_SB_RX
create_bd_pin -dir I sdi_rx_clk
create_bd_pin -dir I sdi_rx_rst
create_bd_pin -dir I clk_300M
create_bd_pin -dir I vfbw_rst
create_bd_pin -dir I video_out_arstn
create_bd_pin -dir I clk_100M
create_bd_pin -dir I resetn_100M
create_bd_pin -dir O rxss_irq
create_bd_pin -dir O vfbw_irq

create_bd_cell -type ip -vlnv xilinx.com:ip:v_frmbuf_wr:2.5 v_frmbuf_wr_0
set_property -dict [list \
  CONFIG.HAS_BGR8 1 \
  CONFIG.HAS_BGRX8 1 \
  CONFIG.HAS_INTERLACED 1 \
  CONFIG.HAS_RGBX8 1 \
  CONFIG.HAS_RGBX10 1 \
  CONFIG.HAS_UYVY8 1 \
  CONFIG.HAS_Y8 1 \
  CONFIG.HAS_Y10 1 \
  CONFIG.HAS_YUV8 1 \
  CONFIG.HAS_YUVX8 1 \
  CONFIG.HAS_YUVX10 1 \
  CONFIG.HAS_YUYV8 1 \
  CONFIG.HAS_Y_UV8 1 \
  CONFIG.HAS_Y_UV10 1 \
  CONFIG.HAS_Y_UV10_420 1 \
  CONFIG.HAS_Y_UV8_420 1 \
  CONFIG.MAX_DATA_WIDTH 10 \
  CONFIG.MAX_NR_PLANES 2 \
] [get_bd_cells v_frmbuf_wr_0]
create_bd_cell -type ip -vlnv xilinx.com:ip:v_smpte_uhdsdi_rx_ss:2.0 v_smpte_uhdsdi_rx_ss_0
set_property -dict {CONFIG.C_EXDESBOARD_VERSION 2} [get_bd_cells v_smpte_uhdsdi_rx_ss_0]

# ---- hierarchy /SDI/GT_COMPACT ----
current_bd_instance /SDI/GT_COMPACT
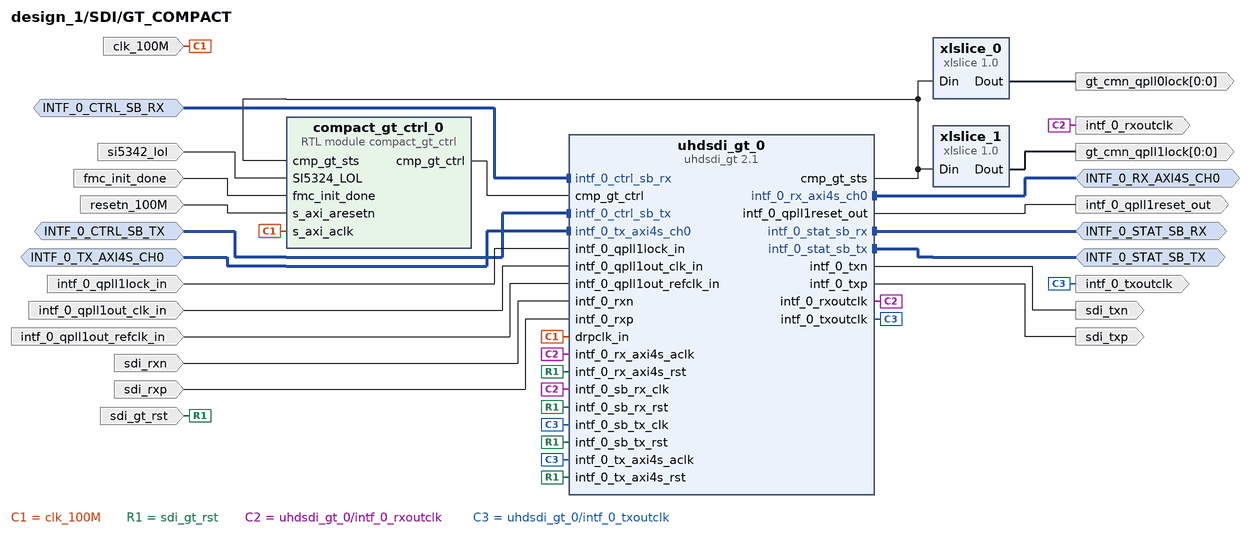
[diagram p7: block diagram inside /SDI/GT_COMPACT]
create_bd_intf_pin -mode Slave -vlnv xilinx.com:interface:axis_rtl:1.0 INTF_0_TX_AXI4S_CH0
create_bd_intf_pin -mode Slave -vlnv xilinx.com:interface:axis_rtl:1.0 INTF_0_CTRL_SB_TX
create_bd_intf_pin -mode Slave -vlnv xilinx.com:interface:axis_rtl:1.0 INTF_0_CTRL_SB_RX
create_bd_intf_pin -mode Master -vlnv xilinx.com:interface:axis_rtl:1.0 INTF_0_STAT_SB_TX
create_bd_intf_pin -mode Master -vlnv xilinx.com:interface:axis_rtl:1.0 INTF_0_RX_AXI4S_CH0
create_bd_intf_pin -mode Master -vlnv xilinx.com:interface:axis_rtl:1.0 INTF_0_STAT_SB_RX
create_bd_pin -dir I clk_100M
create_bd_pin -dir I resetn_100M
create_bd_pin -dir I sdi_rxp
create_bd_pin -dir I sdi_rxn
create_bd_pin -dir O -from 0 -to 0 gt_cmn_qpll0lock
create_bd_pin -dir O -from 0 -to 0 gt_cmn_qpll1lock
create_bd_pin -dir O sdi_txp
create_bd_pin -dir O sdi_txn
create_bd_pin -dir O intf_0_txoutclk
create_bd_pin -dir O intf_0_rxoutclk
create_bd_pin -dir I fmc_init_done
create_bd_pin -dir I si5342_lol
create_bd_pin -dir I sdi_gt_rst
create_bd_pin -dir I intf_0_qpll1out_clk_in
create_bd_pin -dir I intf_0_qpll1out_refclk_in
create_bd_pin -dir I intf_0_qpll1lock_in
create_bd_pin -dir O intf_0_qpll1reset_out

create_bd_cell -type module -reference compact_gt_ctrl compact_gt_ctrl_0
create_bd_cell -type ip -vlnv xilinx.com:ip:uhdsdi_gt:2.1 uhdsdi_gt_0
set_property -dict [list \
  CONFIG.C_DRP_CLK_FREQ 10.000 \
  CONFIG.C_Rx_PLL2_Selection_INTF_0 2 \
  CONFIG.C_Rx_PLL_Selection_INTF_0 2 \
  CONFIG.C_Tx_PLL2_Selection_INTF_0 2 \
  CONFIG.C_Tx_PLL2_Selection_INTF_1 1 \
  CONFIG.C_Tx_PLL2_Selection_INTF_2 1 \
  CONFIG.C_Tx_PLL2_Selection_INTF_3 1 \
  CONFIG.C_Tx_PLL_Selection_INTF_0 2 \
  CONFIG.SupportLevel 0 \
] [get_bd_cells uhdsdi_gt_0]
create_bd_cell -type ip -vlnv xilinx.com:ip:xlslice:1.0 xlslice_0
set_property -dict {CONFIG.DIN_WIDTH 64} [get_bd_cells xlslice_0]
create_bd_cell -type ip -vlnv xilinx.com:ip:xlslice:1.0 xlslice_1
set_property -dict {CONFIG.DIN_FROM 1 CONFIG.DIN_TO 1 CONFIG.DIN_WIDTH 64 CONFIG.DOUT_WIDTH 1} [get_bd_cells xlslice_1]

# ---- hierarchy /ETH_10G ----
current_bd_instance /ETH_10G
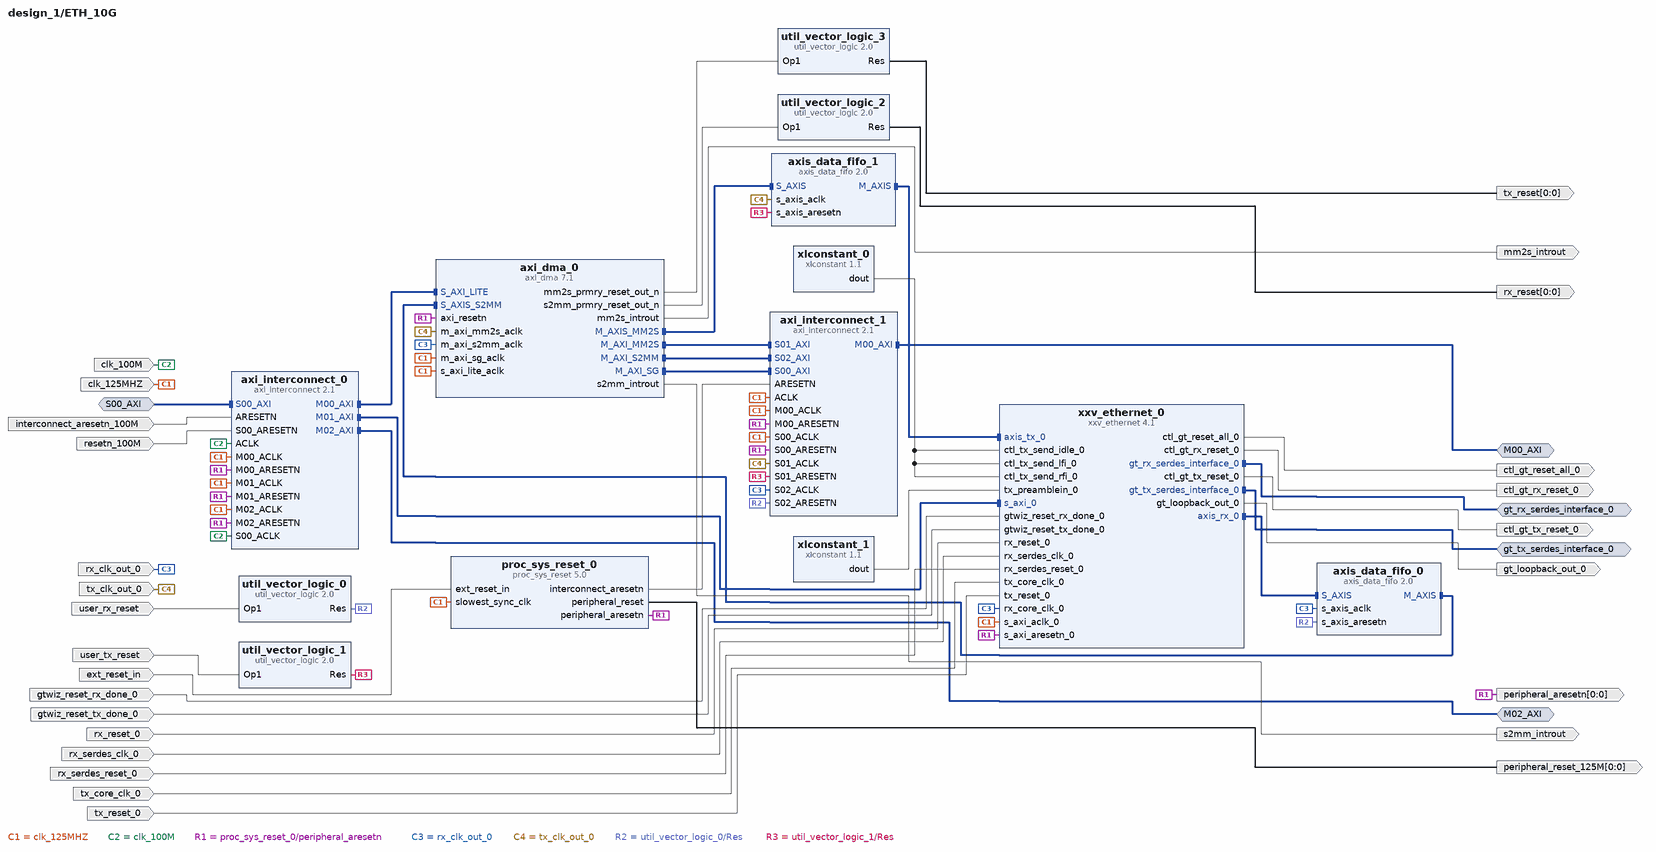
[diagram p8: block diagram inside /ETH_10G]
create_bd_intf_pin -mode Slave -vlnv xilinx.com:interface:aximm_rtl:1.0 S00_AXI
create_bd_intf_pin -mode Master -vlnv xilinx.com:interface:aximm_rtl:1.0 M00_AXI
create_bd_intf_pin -mode Master -vlnv xilinx.com:interface:gt_tx_interface_rtl:1.0 gt_tx_serdes_interface_0
create_bd_intf_pin -mode Master -vlnv xilinx.com:interface:gt_rx_interface_rtl:1.0 gt_rx_serdes_interface_0
create_bd_intf_pin -mode Master -vlnv xilinx.com:interface:aximm_rtl:1.0 M02_AXI
create_bd_pin -dir I rx_clk_out_0
create_bd_pin -dir I rx_serdes_clk_0
create_bd_pin -dir I rx_serdes_reset_0
create_bd_pin -dir I tx_core_clk_0
create_bd_pin -dir I clk_125MHZ
create_bd_pin -dir I ext_reset_in
create_bd_pin -dir O -from 0 -to 0 peripheral_reset_125M
create_bd_pin -dir I rx_reset_0
create_bd_pin -dir I tx_reset_0
create_bd_pin -dir I gtwiz_reset_tx_done_0
create_bd_pin -dir I gtwiz_reset_rx_done_0
create_bd_pin -dir O ctl_gt_reset_all_0
create_bd_pin -dir O ctl_gt_tx_reset_0
create_bd_pin -dir O ctl_gt_rx_reset_0
create_bd_pin -dir O gt_loopback_out_0
create_bd_pin -dir I clk_100M
create_bd_pin -dir I interconnect_aresetn_100M
create_bd_pin -dir I resetn_100M
create_bd_pin -dir I user_rx_reset
create_bd_pin -dir I user_tx_reset
create_bd_pin -dir I tx_clk_out_0
create_bd_pin -dir O -from 0 -to 0 tx_reset
create_bd_pin -dir O -from 0 -to 0 rx_reset
create_bd_pin -dir O mm2s_introut
create_bd_pin -dir O s2mm_introut
create_bd_pin -dir O -from 0 -to 0 -type rst peripheral_aresetn

create_bd_cell -type ip -vlnv xilinx.com:ip:axi_dma:7.1 axi_dma_0
set_property -dict [list \
  CONFIG.c_include_mm2s_dre 1 \
  CONFIG.c_include_s2mm_dre 1 \
  CONFIG.c_m_axi_mm2s_data_width 64 \
  CONFIG.c_m_axi_s2mm_data_width 64 \
  CONFIG.c_m_axis_mm2s_tdata_width 64 \
  CONFIG.c_mm2s_burst_size 16 \
  CONFIG.c_sg_include_stscntrl_strm 0 \
  CONFIG.c_sg_length_width 16 \
] [get_bd_cells axi_dma_0]
create_bd_cell -type ip -vlnv xilinx.com:ip:axi_interconnect:2.1 axi_interconnect_0
set_property -dict {CONFIG.NUM_MI 3} [get_bd_cells axi_interconnect_0]
create_bd_cell -type ip -vlnv xilinx.com:ip:axi_interconnect:2.1 axi_interconnect_1
set_property -dict {CONFIG.NUM_MI 1 CONFIG.NUM_SI 3} [get_bd_cells axi_interconnect_1]
create_bd_cell -type ip -vlnv xilinx.com:ip:axis_data_fifo:2.0 axis_data_fifo_0
set_property -dict {CONFIG.FIFO_DEPTH 8192 CONFIG.FIFO_MODE 2} [get_bd_cells axis_data_fifo_0]
create_bd_cell -type ip -vlnv xilinx.com:ip:axis_data_fifo:2.0 axis_data_fifo_1
set_property -dict {CONFIG.FIFO_DEPTH 8192 CONFIG.FIFO_MODE 2} [get_bd_cells axis_data_fifo_1]
create_bd_cell -type ip -vlnv xilinx.com:ip:proc_sys_reset:5.0 proc_sys_reset_0
create_bd_cell -type ip -vlnv xilinx.com:ip:util_vector_logic:2.0 util_vector_logic_0
set_property -dict {CONFIG.C_OPERATION not CONFIG.C_SIZE 1} [get_bd_cells util_vector_logic_0]
create_bd_cell -type ip -vlnv xilinx.com:ip:util_vector_logic:2.0 util_vector_logic_1
set_property -dict {CONFIG.C_OPERATION not CONFIG.C_SIZE 1} [get_bd_cells util_vector_logic_1]
create_bd_cell -type ip -vlnv xilinx.com:ip:util_vector_logic:2.0 util_vector_logic_2
set_property -dict {CONFIG.C_OPERATION not CONFIG.C_SIZE 1} [get_bd_cells util_vector_logic_2]
create_bd_cell -type ip -vlnv xilinx.com:ip:util_vector_logic:2.0 util_vector_logic_3
set_property -dict {CONFIG.C_OPERATION not CONFIG.C_SIZE 1} [get_bd_cells util_vector_logic_3]
create_bd_cell -type ip -vlnv xilinx.com:ip:xlconstant:1.1 xlconstant_0
set_property -dict {CONFIG.CONST_VAL 0} [get_bd_cells xlconstant_0]
create_bd_cell -type ip -vlnv xilinx.com:ip:xlconstant:1.1 xlconstant_1
set_property -dict {CONFIG.CONST_VAL 0 CONFIG.CONST_WIDTH 56} [get_bd_cells xlconstant_1]
create_bd_cell -type ip -vlnv xilinx.com:ip:xxv_ethernet:4.1 xxv_ethernet_0
set_property -dict [list \
  CONFIG.BASE_R_KR BASE-R \
  CONFIG.GT_GROUP_SELECT Quad_X0Y1 \
  CONFIG.GT_LOCATION 0 \
  CONFIG.INCLUDE_AXI4_INTERFACE 1 \
  CONFIG.INCLUDE_STATISTICS_COUNTERS 1 \
  CONFIG.LANE1_GT_LOC X0Y4 \
] [get_bd_cells xxv_ethernet_0]

# ---- connections ----

current_bd_instance /PS_SUBSYSTEM
connect_bd_intf_net [get_bd_intf_pins S_AXI_HP1_FPD] [get_bd_intf_pins zynq_ultra_ps_e_0/S_AXI_HP1_FPD]
connect_bd_intf_net [get_bd_intf_pins S_AXI_HP2_FPD] [get_bd_intf_pins zynq_ultra_ps_e_0/S_AXI_HP2_FPD]
connect_bd_intf_net [get_bd_intf_pins M00_AXI] [get_bd_intf_pins axi_interconnect_0/M00_AXI]
connect_bd_intf_net [get_bd_intf_pins M01_AXI] [get_bd_intf_pins axi_interconnect_0/M01_AXI]
connect_bd_intf_net [get_bd_intf_pins gem_3_mdio] [get_bd_intf_pins zynq_ultra_ps_e_0/MDIO_ENET3]
connect_bd_intf_net [get_bd_intf_pins zynq_ultra_ps_e_0/M_AXI_HPM0_FPD] [get_bd_intf_pins axi_interconnect_0/S00_AXI]
connect_bd_intf_net [get_bd_intf_pins M_AXI_HPM0_LPD] [get_bd_intf_pins zynq_ultra_ps_e_0/M_AXI_HPM0_LPD]
connect_bd_intf_net [get_bd_intf_pins M_AXI_HPM1_FPD] [get_bd_intf_pins zynq_ultra_ps_e_0/M_AXI_HPM1_FPD]
connect_bd_net [get_bd_pins dp_aux_p] [get_bd_pins util_ds_buf_0/IOBUF_DS_P]
connect_bd_net [get_bd_pins dp_aux_n] [get_bd_pins util_ds_buf_0/IOBUF_DS_N]
connect_bd_net [get_bd_pins zynq_ultra_ps_e_0/pl_resetn0] \
  [get_bd_pins pl_resetn0] [get_bd_pins proc_sys_reset_0/ext_reset_in] [get_bd_pins proc_sys_reset_1/ext_reset_in]
connect_bd_net [get_bd_pins xlconstant_0/dout] [get_bd_pins proc_sys_reset_0/dcm_locked] [get_bd_pins proc_sys_reset_1/dcm_locked]
connect_bd_net [get_bd_pins dp_hpd] [get_bd_pins zynq_ultra_ps_e_0/dp_hot_plug_detect]
connect_bd_net [get_bd_pins emio_gpio_i] [get_bd_pins zynq_ultra_ps_e_0/emio_gpio_i]
connect_bd_net -net pl_ps_irq0_1 [get_bd_pins pl_ps_irq0] [get_bd_pins zynq_ultra_ps_e_0/pl_ps_irq0]
connect_bd_net [get_bd_pins proc_sys_reset_0/interconnect_aresetn] [get_bd_pins interconnect_aresetn_100M] [get_bd_pins axi_interconnect_0/ARESETN]
connect_bd_net [get_bd_pins proc_sys_reset_0/peripheral_aresetn] \
  [get_bd_pins peripheral_aresetn_100M] [get_bd_pins axi_interconnect_0/S00_ARESETN] \
  [get_bd_pins axi_interconnect_0/M00_ARESETN] [get_bd_pins axi_interconnect_0/M01_ARESETN]
connect_bd_net [get_bd_pins proc_sys_reset_0/peripheral_reset] [get_bd_pins peripheral_reset_100M]
connect_bd_net [get_bd_pins proc_sys_reset_1/interconnect_aresetn] [get_bd_pins interconnect_aresetn_300M]
connect_bd_net [get_bd_pins proc_sys_reset_1/peripheral_aresetn] [get_bd_pins peripheral_aresetn_300M]
connect_bd_net [get_bd_pins util_ds_buf_0/IOBUF_IO_O] [get_bd_pins zynq_ultra_ps_e_0/dp_aux_data_in]
connect_bd_net [get_bd_pins zynq_ultra_ps_e_0/dp_aux_data_oe_n] [get_bd_pins util_ds_buf_0/IOBUF_IO_T]
connect_bd_net [get_bd_pins zynq_ultra_ps_e_0/dp_aux_data_out] [get_bd_pins util_ds_buf_0/IOBUF_IO_I]
connect_bd_net [get_bd_pins zynq_ultra_ps_e_0/emio_gpio_o] [get_bd_pins emio_gpio_o]
connect_bd_net [get_bd_pins zynq_ultra_ps_e_0/pl_clk0] \
  [get_bd_pins pl_clk_100M] [get_bd_pins axi_interconnect_0/ACLK] [get_bd_pins axi_interconnect_0/S00_ACLK] \
  [get_bd_pins axi_interconnect_0/M00_ACLK] [get_bd_pins axi_interconnect_0/M01_ACLK] \
  [get_bd_pins proc_sys_reset_0/slowest_sync_clk] [get_bd_pins zynq_ultra_ps_e_0/maxihpm0_fpd_aclk] \
  [get_bd_pins zynq_ultra_ps_e_0/maxihpm1_fpd_aclk] [get_bd_pins zynq_ultra_ps_e_0/maxihpm0_lpd_aclk]
connect_bd_net [get_bd_pins zynq_ultra_ps_e_0/pl_clk1] \
  [get_bd_pins pl_clk_300M] [get_bd_pins proc_sys_reset_1/slowest_sync_clk] [get_bd_pins zynq_ultra_ps_e_0/saxihp1_fpd_aclk]
connect_bd_net [get_bd_pins zynq_ultra_ps_e_0/pl_clk2] [get_bd_pins pl_clk_125M] [get_bd_pins zynq_ultra_ps_e_0/saxihp2_fpd_aclk]

current_bd_instance /DDR4
connect_bd_intf_net [get_bd_intf_pins M01_AXI] [get_bd_intf_pins axi_interconnect_0/M01_AXI]
connect_bd_intf_net [get_bd_intf_pins S00_AXI] [get_bd_intf_pins axi_interconnect_0/S00_AXI]
connect_bd_intf_net [get_bd_intf_pins axi_interconnect_0/M00_AXI] [get_bd_intf_pins ddr4_0/C0_DDR4_S_AXI]
connect_bd_intf_net [get_bd_intf_pins ddr4] [get_bd_intf_pins ddr4_0/C0_DDR4]
connect_bd_intf_net [get_bd_intf_pins ddr4_sysclk] [get_bd_intf_pins ddr4_0/C0_SYS_CLK]
connect_bd_net -net ACLK_1 [get_bd_pins clk_100M] \
  [get_bd_pins axi_interconnect_0/ACLK] [get_bd_pins axi_interconnect_0/S00_ACLK] [get_bd_pins axi_interconnect_0/M01_ACLK]
connect_bd_net -net ARESETN_1 [get_bd_pins resetn_100M] \
  [get_bd_pins axi_interconnect_0/ARESETN] [get_bd_pins axi_interconnect_0/S00_ARESETN] \
  [get_bd_pins axi_interconnect_0/M01_ARESETN]
connect_bd_net -net M00_ACLK_1 [get_bd_pins ddr4_0/c0_ddr4_ui_clk] \
  [get_bd_pins axi_interconnect_0/M00_ACLK] [get_bd_pins proc_sys_reset_0/slowest_sync_clk]
connect_bd_net [get_bd_pins ddr4_0/c0_ddr4_ui_clk_sync_rst] [get_bd_pins proc_sys_reset_0/ext_reset_in]
connect_bd_net [get_bd_pins proc_sys_reset_0/peripheral_aresetn] [get_bd_pins axi_interconnect_0/M00_ARESETN] [get_bd_pins ddr4_0/c0_ddr4_aresetn]
connect_bd_net [get_bd_pins sys_rst] [get_bd_pins ddr4_0/sys_rst]

current_bd_instance /GPIO
connect_bd_intf_net [get_bd_intf_pins S00_AXI] [get_bd_intf_pins axi_interconnect_0/S00_AXI]
connect_bd_intf_net [get_bd_intf_pins board_config_gpio] [get_bd_intf_pins board_config_axi_gpio/GPIO]
connect_bd_intf_net [get_bd_intf_pins pmod_gpio_1] [get_bd_intf_pins pmod_axi_gpio/GPIO]
connect_bd_intf_net [get_bd_intf_pins pmod_gpio_2] [get_bd_intf_pins pmod_axi_gpio/GPIO2]
connect_bd_intf_net [get_bd_intf_pins fmc1_gpio_1] [get_bd_intf_pins fmc1_axi_gpio_0/GPIO]
connect_bd_intf_net [get_bd_intf_pins fmc1_gpio_2] [get_bd_intf_pins fmc1_axi_gpio_0/GPIO2]
connect_bd_intf_net [get_bd_intf_pins fmc1_gpio_3] [get_bd_intf_pins fmc1_axi_gpio_1/GPIO]
connect_bd_intf_net [get_bd_intf_pins fmc2_gpio_1] [get_bd_intf_pins fmc2_axi_gpio_0/GPIO]
connect_bd_intf_net [get_bd_intf_pins fmc2_gpio_2] [get_bd_intf_pins fmc2_axi_gpio_0/GPIO2]
connect_bd_intf_net [get_bd_intf_pins axi_interconnect_0/M00_AXI] [get_bd_intf_pins board_config_axi_gpio/S_AXI]
connect_bd_intf_net [get_bd_intf_pins axi_interconnect_0/M01_AXI] [get_bd_intf_pins pmod_axi_gpio/S_AXI]
connect_bd_intf_net [get_bd_intf_pins axi_interconnect_0/M02_AXI] [get_bd_intf_pins fmc1_axi_gpio_0/S_AXI]
connect_bd_intf_net [get_bd_intf_pins axi_interconnect_0/M03_AXI] [get_bd_intf_pins fmc1_axi_gpio_1/S_AXI]
connect_bd_intf_net [get_bd_intf_pins axi_interconnect_0/M04_AXI] [get_bd_intf_pins fmc2_axi_gpio_0/S_AXI]
connect_bd_net -net ACLK_1 [get_bd_pins clk_100M] \
  [get_bd_pins board_config_axi_gpio/s_axi_aclk] [get_bd_pins pmod_axi_gpio/s_axi_aclk] \
  [get_bd_pins fmc1_axi_gpio_0/s_axi_aclk] [get_bd_pins fmc1_axi_gpio_1/s_axi_aclk] [get_bd_pins fmc2_axi_gpio_0/s_axi_aclk] \
  [get_bd_pins axi_interconnect_0/ACLK] [get_bd_pins axi_interconnect_0/S00_ACLK] [get_bd_pins axi_interconnect_0/M00_ACLK] \
  [get_bd_pins axi_interconnect_0/M01_ACLK] [get_bd_pins axi_interconnect_0/M02_ACLK] \
  [get_bd_pins axi_interconnect_0/M03_ACLK] [get_bd_pins axi_interconnect_0/M04_ACLK]
connect_bd_net -net S00_ARESETN_1 [get_bd_pins resetn_100M] \
  [get_bd_pins board_config_axi_gpio/s_axi_aresetn] [get_bd_pins pmod_axi_gpio/s_axi_aresetn] \
  [get_bd_pins fmc1_axi_gpio_0/s_axi_aresetn] [get_bd_pins fmc1_axi_gpio_1/s_axi_aresetn] \
  [get_bd_pins fmc2_axi_gpio_0/s_axi_aresetn] [get_bd_pins axi_interconnect_0/S00_ARESETN] \
  [get_bd_pins axi_interconnect_0/M00_ARESETN] [get_bd_pins axi_interconnect_0/M01_ARESETN] \
  [get_bd_pins axi_interconnect_0/M02_ARESETN] [get_bd_pins axi_interconnect_0/M03_ARESETN] \
  [get_bd_pins axi_interconnect_0/M04_ARESETN]
connect_bd_net [get_bd_pins interconnect_aresetn_100M] [get_bd_pins axi_interconnect_0/ARESETN]

current_bd_instance /SDI
connect_bd_intf_net [get_bd_intf_pins GT_COMPACT/INTF_0_RX_AXI4S_CH0] [get_bd_intf_pins SDI_IN/S_AXIS_RX]
connect_bd_intf_net [get_bd_intf_pins GT_COMPACT/INTF_0_STAT_SB_RX] [get_bd_intf_pins SDI_IN/S_AXIS_STS_SB_RX]
connect_bd_intf_net [get_bd_intf_pins GT_COMPACT/INTF_0_STAT_SB_TX] [get_bd_intf_pins SDI_OUT/S_AXIS_STS_SB_TX]
connect_bd_intf_net [get_bd_intf_pins GT_COMPACT/INTF_0_CTRL_SB_RX] [get_bd_intf_pins SDI_IN/M_AXIS_CTRL_SB_RX]
connect_bd_intf_net [get_bd_intf_pins GT_COMPACT/INTF_0_CTRL_SB_TX] [get_bd_intf_pins SDI_OUT/M_AXIS_CTRL_SB_TX]
connect_bd_intf_net [get_bd_intf_pins S00_AXI] [get_bd_intf_pins axi_interconnect_0/S00_AXI]
connect_bd_intf_net [get_bd_intf_pins SDI_IN/M_AXI_MM_VIDEO] [get_bd_intf_pins axi_interconnect_1/S00_AXI]
connect_bd_intf_net [get_bd_intf_pins SDI_OUT/M_AXIS_TX] [get_bd_intf_pins GT_COMPACT/INTF_0_TX_AXI4S_CH0]
connect_bd_intf_net [get_bd_intf_pins SDI_OUT/M_AXI_MM_VIDEO] [get_bd_intf_pins axi_interconnect_1/S01_AXI]
connect_bd_intf_net [get_bd_intf_pins axi_gpio_1/S_AXI] [get_bd_intf_pins axi_interconnect_0/M02_AXI]
connect_bd_intf_net [get_bd_intf_pins axi_interconnect_0/M00_AXI] [get_bd_intf_pins SDI_OUT/S_AXI_TXSS]
connect_bd_intf_net [get_bd_intf_pins axi_interconnect_0/M01_AXI] [get_bd_intf_pins SDI_IN/S_AXI_RXSS]
connect_bd_intf_net [get_bd_intf_pins axi_gpio_0/S_AXI] [get_bd_intf_pins axi_interconnect_0/M03_AXI]
connect_bd_intf_net [get_bd_intf_pins axi_interconnect_0/M04_AXI] [get_bd_intf_pins SDI_OUT/S_AXI_VFBR]
connect_bd_intf_net [get_bd_intf_pins axi_interconnect_0/M05_AXI] [get_bd_intf_pins SDI_IN/S_AXI_VFBW]
connect_bd_intf_net [get_bd_intf_pins M00_AXI] [get_bd_intf_pins axi_interconnect_1/M00_AXI]
connect_bd_net -net ACLK_1 [get_bd_pins clk_100M] \
  [get_bd_pins SDI_OUT/clk_100M] [get_bd_pins SDI_IN/clk_100M] [get_bd_pins GT_COMPACT/clk_100M] \
  [get_bd_pins axi_gpio_0/s_axi_aclk] [get_bd_pins axi_gpio_1/s_axi_aclk] [get_bd_pins axi_interconnect_0/ACLK] \
  [get_bd_pins axi_interconnect_0/S00_ACLK] [get_bd_pins axi_interconnect_0/M00_ACLK] \
  [get_bd_pins axi_interconnect_0/M01_ACLK] [get_bd_pins axi_interconnect_0/M02_ACLK] \
  [get_bd_pins axi_interconnect_0/M03_ACLK]
connect_bd_net -net FRM_BUF_RST_vfbr_rst [get_bd_pins xlslice_2/Dout] [get_bd_pins SDI_OUT/vfbr_rst]
connect_bd_net -net FRM_BUF_RST_vfbw_rst [get_bd_pins xlslice_3/Dout] [get_bd_pins SDI_IN/vfbw_rst]
connect_bd_net [get_bd_pins GT_COMPACT/gt_cmn_qpll1lock] [get_bd_pins proc_sys_reset_0/aux_reset_in]
connect_bd_net [get_bd_pins GT_COMPACT/intf_0_qpll1reset_out] [get_bd_pins intf_0_qpll1reset_out]
connect_bd_net [get_bd_pins GT_COMPACT/intf_0_rxoutclk] [get_bd_pins SDI_IN/sdi_rx_clk]
connect_bd_net [get_bd_pins GT_COMPACT/intf_0_txoutclk] [get_bd_pins SDI_OUT/sdi_tx_clk]
connect_bd_net [get_bd_pins GT_COMPACT/sdi_txn] [get_bd_pins sdi_txn]
connect_bd_net [get_bd_pins GT_COMPACT/sdi_txp] [get_bd_pins sdi_txp]
connect_bd_net -net M05_ACLK_1 [get_bd_pins clk_300M] \
  [get_bd_pins SDI_OUT/clk_300M] [get_bd_pins SDI_IN/clk_300M] [get_bd_pins axi_interconnect_0/M04_ACLK] \
  [get_bd_pins axi_interconnect_0/M05_ACLK] [get_bd_pins axi_interconnect_1/ACLK] [get_bd_pins axi_interconnect_1/S00_ACLK] \
  [get_bd_pins axi_interconnect_1/S01_ACLK] [get_bd_pins axi_interconnect_1/M00_ACLK] \
  [get_bd_pins proc_sys_reset_0/slowest_sync_clk]
connect_bd_net -net S00_ARESETN_1 [get_bd_pins resetn_300M] \
  [get_bd_pins axi_interconnect_0/M04_ARESETN] [get_bd_pins axi_interconnect_0/M05_ARESETN] \
  [get_bd_pins axi_interconnect_1/S00_ARESETN] [get_bd_pins axi_interconnect_1/S01_ARESETN] \
  [get_bd_pins axi_interconnect_1/M00_ARESETN]
connect_bd_net -net S00_ARESETN_2 [get_bd_pins resetn_100M] \
  [get_bd_pins SDI_OUT/reset_100M] [get_bd_pins SDI_IN/resetn_100M] [get_bd_pins GT_COMPACT/resetn_100M] \
  [get_bd_pins axi_gpio_0/s_axi_aresetn] [get_bd_pins axi_gpio_1/s_axi_aresetn] [get_bd_pins axi_interconnect_0/S00_ARESETN] \
  [get_bd_pins axi_interconnect_0/M00_ARESETN] [get_bd_pins axi_interconnect_0/M01_ARESETN] \
  [get_bd_pins axi_interconnect_0/M02_ARESETN] [get_bd_pins axi_interconnect_0/M03_ARESETN]
connect_bd_net [get_bd_pins SDI_IN/rxss_irq] [get_bd_pins xlconcat_0/In0]
connect_bd_net [get_bd_pins SDI_IN/vfbw_irq] [get_bd_pins xlconcat_0/In1]
connect_bd_net [get_bd_pins SDI_OUT/txss_irq] [get_bd_pins xlconcat_0/In2]
connect_bd_net [get_bd_pins SDI_OUT/vfbr_irq] [get_bd_pins xlconcat_0/In3]
connect_bd_net [get_bd_pins axi_gpio_0/gpio_io_o] [get_bd_pins xlslice_0/Din] [get_bd_pins xlslice_1/Din]
connect_bd_net -net axi_gpio_0_gpio_io_o_1 [get_bd_pins axi_gpio_1/gpio_io_o] [get_bd_pins xlslice_2/Din] [get_bd_pins xlslice_3/Din]
connect_bd_net [get_bd_pins ext_reset_in] [get_bd_pins proc_sys_reset_0/ext_reset_in]
connect_bd_net [get_bd_pins interconnect_aresetn_100M] [get_bd_pins axi_interconnect_0/ARESETN]
connect_bd_net [get_bd_pins interconnect_aresetn_300M] [get_bd_pins axi_interconnect_1/ARESETN]
connect_bd_net [get_bd_pins intf_0_qpll1lock_in] [get_bd_pins GT_COMPACT/intf_0_qpll1lock_in]
connect_bd_net [get_bd_pins intf_0_qpll1out_clk_in] [get_bd_pins GT_COMPACT/intf_0_qpll1out_clk_in]
connect_bd_net [get_bd_pins intf_0_qpll1out_refclk_in] [get_bd_pins GT_COMPACT/intf_0_qpll1out_refclk_in]
connect_bd_net -net irq0_1 [get_bd_pins irq0] [get_bd_pins xlconcat_0/In4]
connect_bd_net -net irq1_1 [get_bd_pins irq1] [get_bd_pins xlconcat_0/In5]
connect_bd_net [get_bd_pins sdi_rxn] [get_bd_pins GT_COMPACT/sdi_rxn]
connect_bd_net [get_bd_pins sdi_rxp] [get_bd_pins GT_COMPACT/sdi_rxp]
connect_bd_net -net video_out_arstn_1 [get_bd_pins proc_sys_reset_0/peripheral_aresetn] \
  [get_bd_pins SDI_IN/video_out_arstn] [get_bd_pins SDI_OUT/video_in_arstn]
connect_bd_net [get_bd_pins xlconcat_0/dout] [get_bd_pins pl_ps_irq0]
connect_bd_net [get_bd_pins xlconstant_0/dout] [get_bd_pins SDI_IN/sdi_rx_rst] [get_bd_pins SDI_OUT/sdi_tx_rst] [get_bd_pins GT_COMPACT/sdi_gt_rst]
connect_bd_net [get_bd_pins xlconstant_1/dout] [get_bd_pins proc_sys_reset_0/dcm_locked]
connect_bd_net [get_bd_pins xlslice_0/Dout] [get_bd_pins GT_COMPACT/fmc_init_done]
connect_bd_net [get_bd_pins xlslice_1/Dout] [get_bd_pins GT_COMPACT/si5342_lol]
